# EasyEDA Pro project 3310USBC-1.eprj

# Schematic Schematic1
Board Name: Board1; Create Date: 2026-04-10; Page Name: P1; Project Name: 3310USBC-3; Schematic Name: Schematic1; Update Date: 2026-04-11; Company: EasyEDA.com; Page Size: A4; Version: V1.0
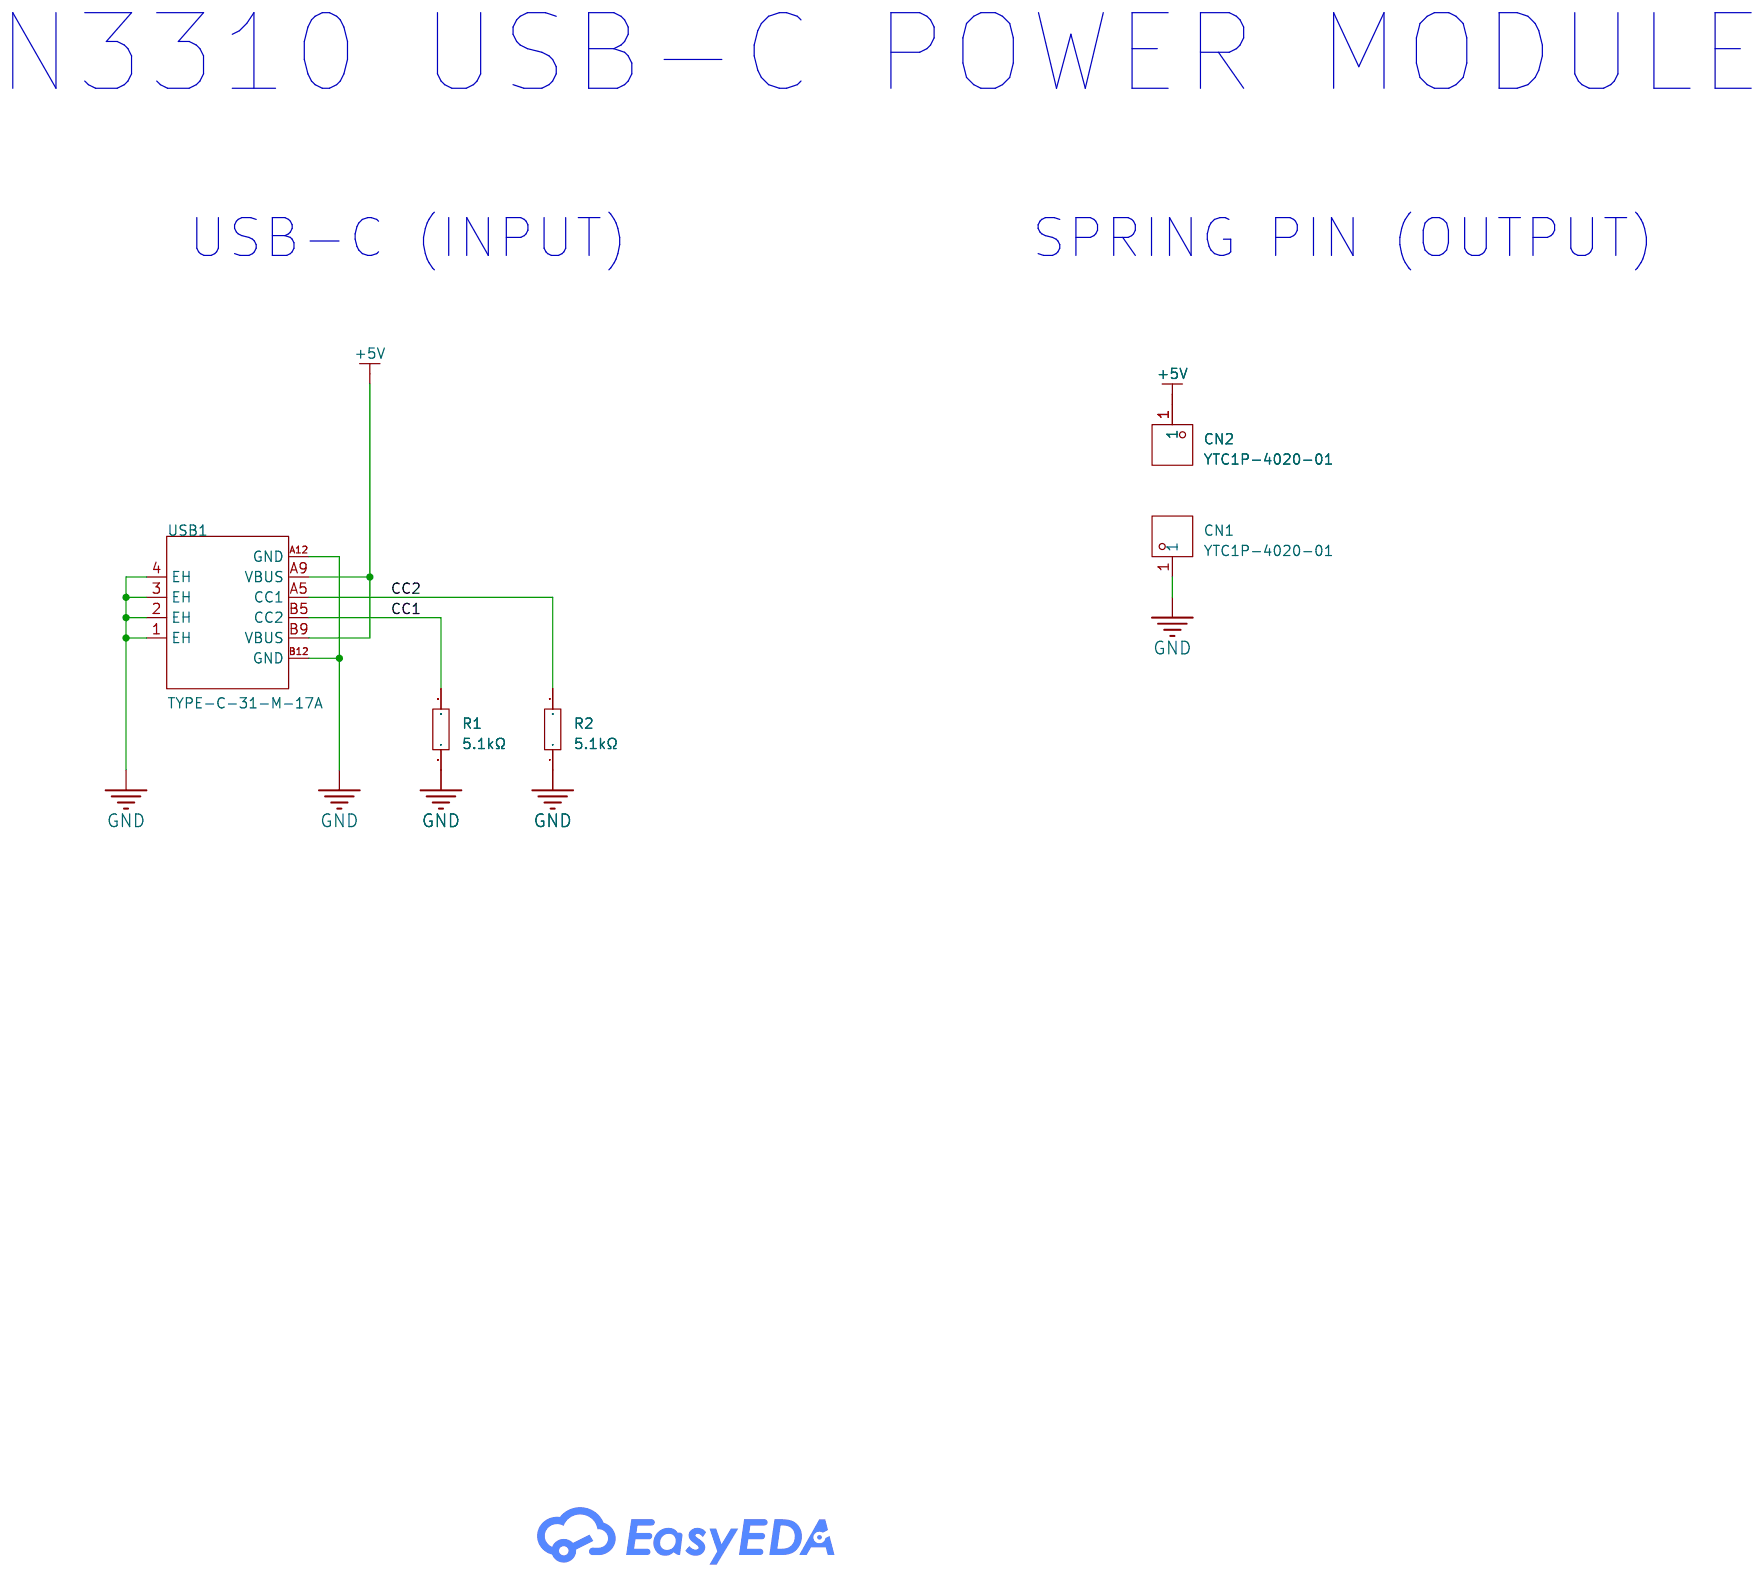
[diagram p0: schematic sheet]

## Parts
CN1  YTC1P-4020-01  [TESTPOINT-SMD_BD2.0_YTC1P-4020-01]
CN2  YTC1P-4020-01  [TESTPOINT-SMD_BD2.0_YTC1P-4020-01]
R1  5.1kΩ  [R0805]
R2  5.1kΩ  [R0805]
USB1  TYPE-C-31-M-17A  [TYPE-C-SMD_TYPE-C-31-M-17A]

## Library data of the parts
CN1 CN2 = YTC1P-4020-01: Type:Pogo Pin Number of Pins:1P Overall Length/Height:6mm Current Rating:2.5A Voltage Rating:12V Contact Material:Brass Contact Plating:Gold; LCSC Part Name: POGO PIN弹簧顶针 贴片连接器; Supplier Part: C5221284; Manufacturer: YIYUAN(怡远); Supplier Footprint: SMD,D=2mm; JLCPCB Part Class: Extended Part; Datasheet: https://item.szlcsc.com/datasheet/YTC1P-4020-01/5919198.html; Supplier: LCSC; Type: Pogo Pin; Number of Pins: 1P; Overall Length/Height: 6mm; Current Rating: 2.5A; Voltage Rating: 12V; Contact Material: Brass; Contact Plating: Gold
R1 R2 = 0805W8F5101T5E: Type:Thick Film Resistor Resistance:5.1kΩ Tolerance:±1% Tolerance:±1% Power(Watts):125mW Voltage-Supply(Max):150V Temperature Coefficient:±100ppm/℃ Temperature Coefficient:±100ppm/℃ Operating Temperature:-55℃~+155℃ Operating Temperature:-55℃~+155℃; LCSC Part Name: 5.1kΩ ±1% 125mW 厚膜电阻; Supplier Part: C27834; Manufacturer: UNI-ROYAL(厚声); Supplier Footprint: 0805; JLCPCB Part Class: Basic Part; Datasheet: https://item.szlcsc.com/datasheet/0805W8F5101T5E/28584.html; Supplier: LCSC; Type: Thick Film Resistor; Tolerance: ±1%; Power(Watts): 125mW; Voltage-Supply(Max): 150V; Temperature Coefficient: ±100ppm/℃; Operating Temperature: -55℃~+155℃
USB1 = TYPE-C-31-M-17A: Connector Type:Type-C Gender:- Mounting Type:Surface Mount, Right Angle Number of Contacts:6P Number of Ports:1 Current Rating-Power:5A Voltage Rating:20V Connect-Disconnect Life:10,000 cycles Length:6.8mm Operating Temperature:-30℃~+80℃ Operating Tempera; LCSC Part Name: Type-C 卧贴; Supplier Part: C22464426; Manufacturer: 韩国韩荣; Supplier Footprint: SMD; JLCPCB Part Class: Extended Part; Datasheet: https://item.szlcsc.com/datasheet/TYPE-C-31-M-17A/24156555.html; Supplier: LCSC; Connector Type: Type-C; Mounting Type: Surface Mount, Right Angle; Number of Contacts: 6P; Number of Ports: 1; Current Rating-Power: 5A; Voltage Rating: 20V; Connect-Disconnect Life: 10,000 cycles; Length: 6.8mm; Operating Temperature: -30℃~+80℃

## Nets
+5V: CN2.1 USB1.A9(VBUS) USB1.B9(VBUS)
GND: CN1.1 R1.1 R2.1 USB1.1(EH) USB1.2(EH) USB1.3(EH) USB1.4(EH) USB1.A12(GND) USB1.B12(GND)
CC1: R1.2 USB1.B5(CC2)
CC2: R2.2 USB1.A5(CC1)

## Notes on the sheet
- N3310 USB-C POWER MODULE
- USB-C (INPUT)
- SPRING PIN (OUTPUT)

# Board PCB1
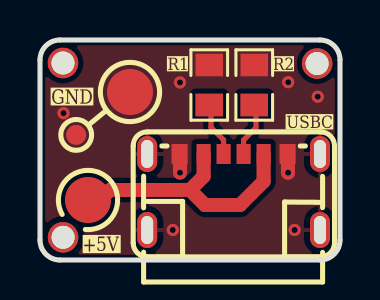
[diagram p1: board, top side]
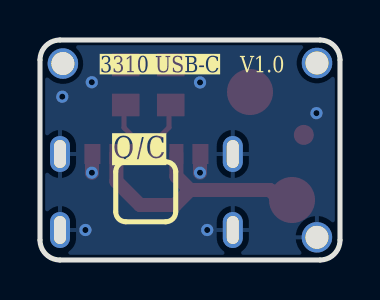
[diagram p2: board, bottom side, seen from below]

Outline 15 x 11 mm; copper layers: Top Layer, Bottom Layer. Coordinates in mm from the lower left corner of the outline.
Outline path: 0,10 0,1 arc(0.29,0.29) 1,0 14,0 arc(14.71,0.29) 15,1 15,10 arc(14.71,10.71) 14,11 1,11 arc(0.29,10.71) 0,10
Stack: Top Layer 0.035mm / Dielectric1 0.91mm FR4 er 4.5 / Bottom Layer 0.035mm

## Design rules (mm)
template: Custom Config
spacing copperThickness1oz (default): track to track 0.127, other pairs 0.152 to 0.3
spacing copperThickness2oz: track to track 0.203, other pairs 0.152 to 0.3
track width copperThickness1oz (default): min 0.127, default 0.254, max 2.54
track width copperThickness2oz: min 0.203, default 0.254, max 2.54
differential pair differentialPair (default): width min 0.127, default 0.254, max 2.54; gap min 0.152, default 0.152
via viaSize (default): diameter min 0.5, default 0.61, max 10; hole min 0.3, default 0.305, max 6.3

## Placement (name value [footprint] x y rotation side)
CN1  YTC1P-4020-01  [TESTPOINT-SMD_BD2.0_YTC1P-4020-01]  4.5 8.4 0 top
CN2  YTC1P-4020-01  [TESTPOINT-SMD_BD2.0_YTC1P-4020-01]  2.4 3 0 top
NOREF  -  [Pad_e387]  1.15 1.13 0 top
NOREF#2  -  [Pad_e374]  13.86 9.82 0 top
NOREF#3  -  [Pad_e124]  1.15 9.85 0 top
NOREF#4  -  [Pad_e306]  1.81 6.25 0 top
R1  5.1kΩ  [R0805]  10.71 8.75 270 top
R2  5.1kΩ  [R0805]  8.46 8.75 270 top
USBC  TYPE-C-31-M-17A  [TYPE-C-SMD_TYPE-C-31-M-17A]  9.68 3.4 0 top

## Footprints (pads in the part's own frame, mm; a bottom-side part is the same pattern mirrored in y, then rotated)
Pad_e124
  round 1.524 hole 1.152: 1(0,0)
Pad_e306
  round 1 smd: 1(0,0)
Pad_e374
  round 1.524 hole 1.152: 1(0,0)
Pad_e387
  round 1.524 hole 1.152: 1(0,0)
R0805
  rect 1.133x1.377 smd: 1(-1,0) 2(1,0)
TESTPOINT-SMD_BD2.0_YTC1P-4020-01
  round 2.3 smd: 1(0,0)
TYPE-C-SMD_TYPE-C-31-M-17A
  oval 1x1.8 hole 0.6x1.4: 1(-4.32,1.9) 2(4.32,1.9) 3(-4.32,-1.9) 4(4.32,-1.9)
  rect 0.7x1 smd: A5(-0.5,1.9) A9(1.5,1.9) B5(0.5,1.9) B9(-1.5,1.9)
  rect 0.8x1 smd: A12(2.7,1.9) B12(-2.7,1.9)

## Nets
+5V: CN2.1 USBC.A9 USBC.B9
GND: CN1.1 NOREF.1 NOREF#4.1 R1.1 R2.1 USBC.1 USBC.2 USBC.3 USBC.4 USBC.A12 USBC.B12
CC1: R1.2 USBC.B5
CC2: R2.2 USBC.A5

Pads without a net: NOREF#2 1; NOREF#3 1

## Via types
v1: diameter 0.61, hole 0.305, Top Layer to Bottom Layer, 8 vias

## Routing (per net, layer and track width the routed paths; a pad name or vN(x,y) marks a point on that pad's centre or on a via; arc(x,y) is an arc through that point)
+5V: length 13.2
  Top Layer w0.7: USBC.B9 8.18,4.18 7.5,3.5 ; 7.5,3.5 3.5,3.5 3,3 CN2.1 ; 7.5,3.5 8.25,2.75 10,2.75 11.18,3.93 USBC.A9
GND: length 1.9
  Top Layer w0.7: 7,5.3 v1(7,4.37) ; 12.4,5.3 12.4,4.37 v1(12.41,4.37)
  vias: v1(1.18,7.34) v1(6.64,1.5) v1(7,8.88) v1(12.41,8.89) v1(12.73,1.5) v1(13.89,8.17)
CC1: length 2.7
  Top Layer w0.254: 10.8,7.75 10.8,6.62 10.18,6 USBC.B5
CC2: length 2.7
  Top Layer w0.254: USBC.A5 9.18,6 8.55,6.63 8.55,7.75

## Copper pours and planes (outline as drawn; the poured copper is in the pictures)
GND on Top Layer: -2.2,12.45 16.9,12.45 16.9,-1.95 -2.2,-1.95
GND on Bottom Layer: -2,12 16,12 16,-0.5 -2,-0.5

## Text on the board
Bottom Silkscreen Layer: V1.0 | 3310 USB-C | Q/C
Top Silkscreen Layer: GND | +5V
